# Altium project Relay.PrjPcb
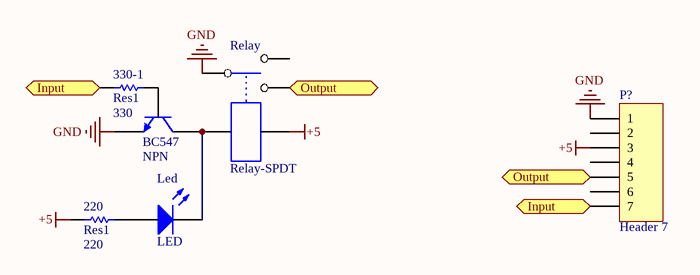
[diagram p0: Relay-2.SchDoc]
1 sheet, 6 parts. Net scope: flat (ports and power ports of the same name join across sheets).
Board file: Relay-2.PcbDoc

## Sheet Relay-2.SchDoc
size A4

### Parts
220  Res1  value 220  [AXIAL-0.3]
330-1  Res1  value 330  [AXIAL-0.3]
BC547  NPN  [TO-226-AA]
Led  LED  [My_LED3MM]
P?  Header 7  [HDR1X7]
Relay  Relay-SPDT  [My_rel]

### Ports
Input (in), Input (out), Output (bidir)

### Nets
+5: 220.1 P?.3 Relay.5
GND: BC547.3(E) P?.1 Relay.1
Net220_2: 220.2 Led.A
Net330-1_1: 330-1.1 P?.7 ; port Input
Net330-1_2: 330-1.2 BC547.2(B)
NetBC547_1: BC547.1(C) Led.K Relay.4
NetP?_5: P?.5 Relay.3 ; port Output

Not connected (* = marked no-connect by the designer): P? 2 4 6; Relay 2

### Library data of the parts
220 330-1 = Res1: Resistor; Published: 8-Jun-2000; LatestRevisionDate: 17-Jul-2002; LatestRevisionNote: Re-released for DXP Platform.; PackageReference: AXIAL-0.3; Publisher: Altium Limited
  330-1: PackageDescription: Axial Device, Thru-Hole; 2 Leads; 0.3 in Pin Spacing
BC547 = NPN: NPN Bipolar Transistor; Published: 8-Jun-2000; LatestRevisionDate: 17-Jul-2002; LatestRevisionNote: Re-released for DXP Platform.; PackageReference: TO-226-AA; Publisher: Altium Limited; PackageDescription: TO, Flat Index; 3 In-Line, Axial Leads; Body Dia. 4.8mm; Leads 0.55 x 0.51 mm (max); Code_JEDEC: TO-226-AA
Led = LED: Typical INFRARED GaAs LED; Published: 8-Jun-2000; LatestRevisionDate: 08-Jul-2005; LatestRevisionNote: Mech Layer 1 removed.; Publisher: Altium Limited
P? = Header 7: Header, 7-Pin; LatestRevisionDate: 17-Jul-2002; LatestRevisionNote: Re-released for DXP Platform.; Publisher: Altium Limited
Relay = Relay-SPDT: standard single contact relay